# EAGLE design LB_BIT_o24_SYNTHSPEAKER-v03(4_5) (EAGLE 6.6.0)
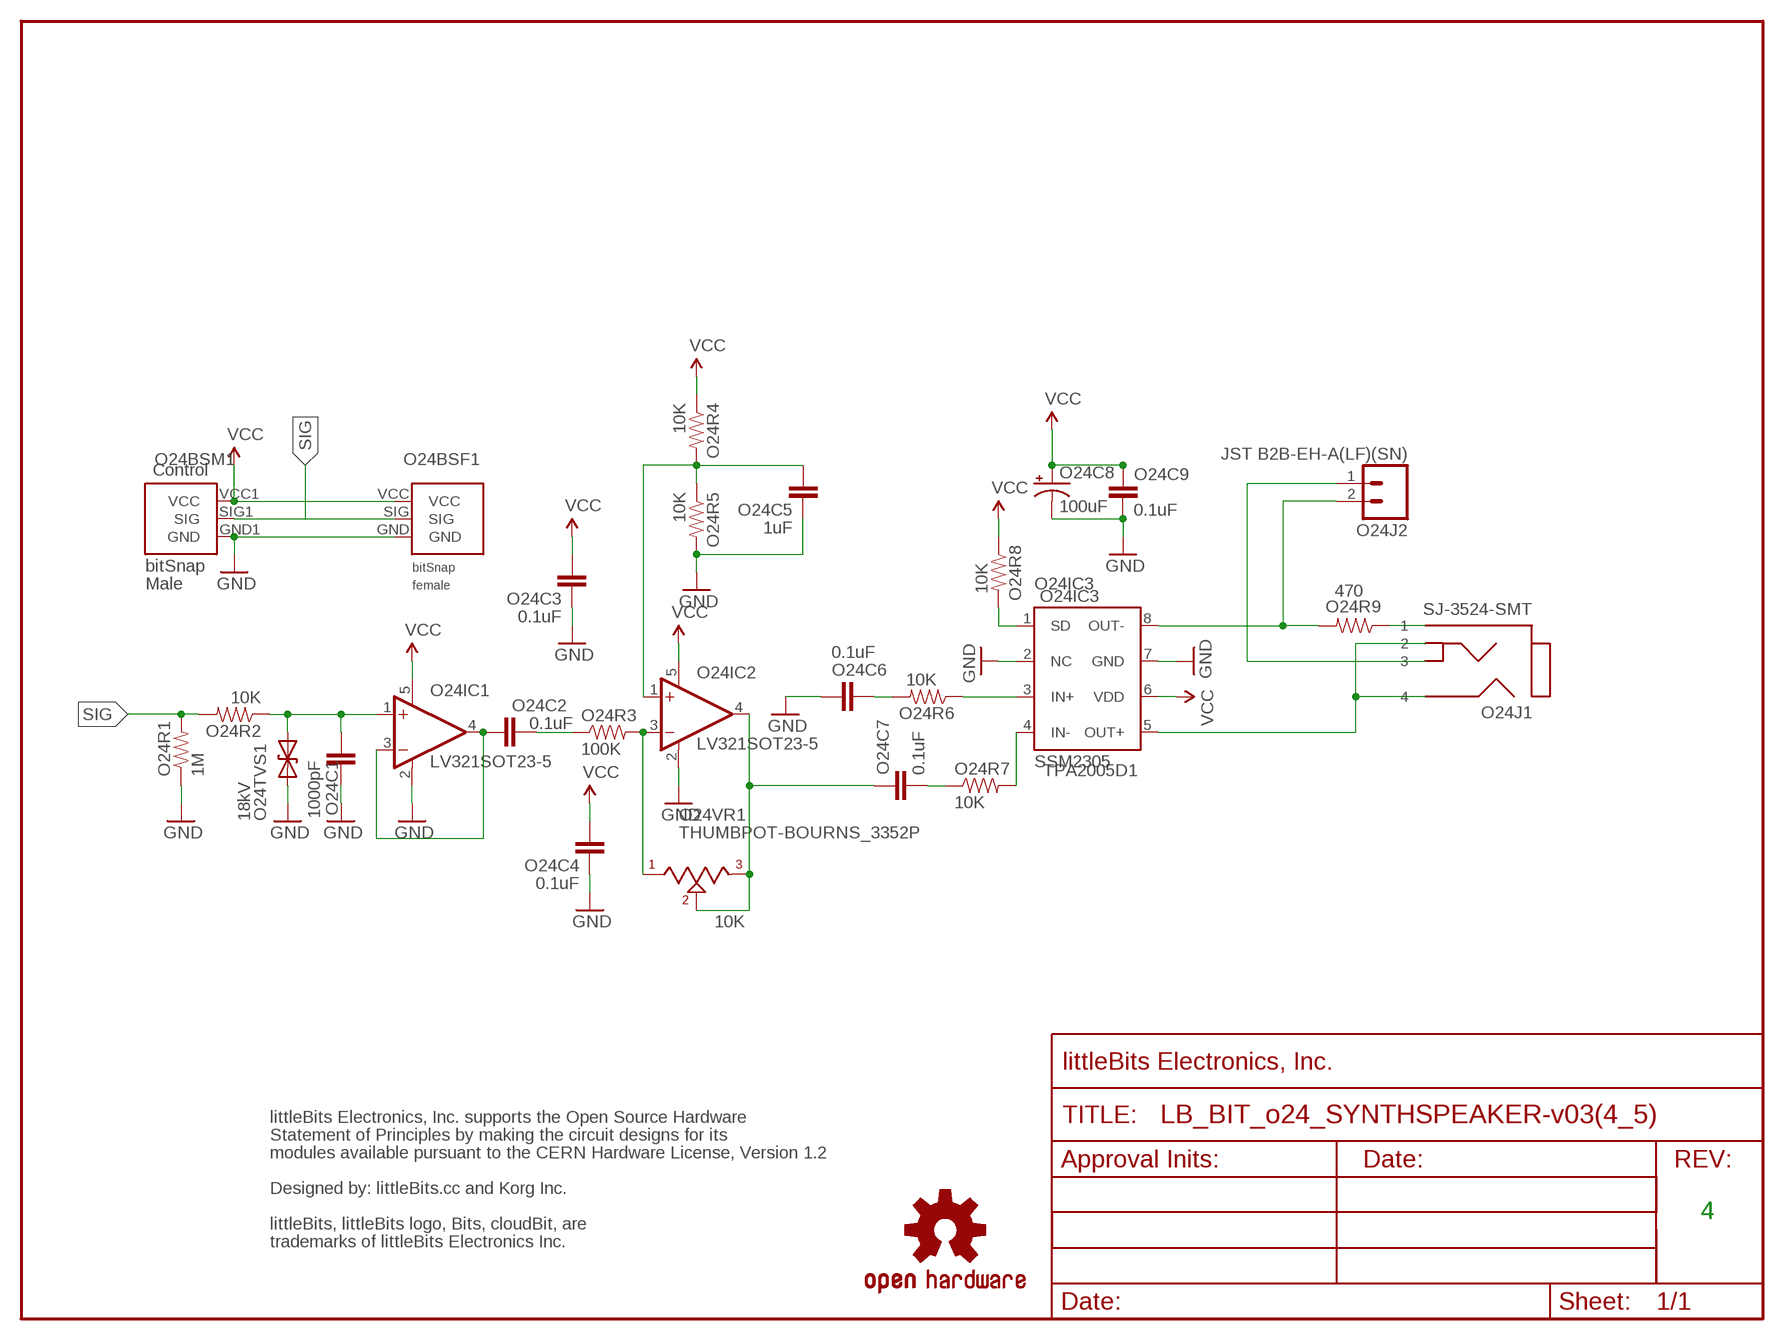
[diagram p0: schematic, sheet 1]

## Parts
$1_28_$  OSHW-LOGOL  [OSHW-LOGO-L]
FRAME1  FRAME-LETTER-OHWOHW  [FABDWG01-OHW]
O24BSF1  BITSNAP_V03_FEMALE  [BITSNAP_V03_FEMALE]
O24BSM1  BITSNAP_V03_MALE  [BITSNAP_V03_MALE]
O24C1  1000pF  CAPCAP-0603  [CAP-0603]
O24C2  0.1uF  CAPCAP-0603  [CAP-0603]
O24C3  0.1uF  CAPCAP-0603  [CAP-0603]
O24C4  0.1uF  CAPCAP-0603  [CAP-0603]
O24C5  1uF  CAPCAP-0603  [CAP-0603]
O24C6  0.1uF  CAPCAP-0603  [CAP-0603]
O24C7  0.1uF  CAPCAP-0603  [CAP-0603]
O24C8  100uF  CAP_POL3216  [EIA3216]
O24C9  0.1uF  CAPCAP-0603  [CAP-0603]
O24IC1  LV321SOT23-5  [SOT23-5]
O24IC2  LV321SOT23-5  [SOT23-5]
O24IC3  SSM2305  [MSOP08]
O24J1  SJ-3524-SMT  PHONO_JACK_SW  [PHONO_JACK_SW]
O24J2  JST B2B-EH-A(LF)(SN)  HDR-2  [H02-JST-B2B-EH-A]
O24R1  1M  RESISTOR0603  [RES-0603]
O24R2  10K  RESISTOR0603  [RES-0603]
O24R3  100K  RESISTOR0603  [RES-0603]
O24R4  10K  RESISTOR0603  [RES-0603]
O24R5  10K  RESISTOR0603  [RES-0603]
O24R6  10K  RESISTOR0603  [RES-0603]
O24R7  10K  RESISTOR0603  [RES-0603]
O24R8  10K  RESISTOR0603  [RES-0603]
O24R9  470  RESISTOR0603  [RES-0603]
O24TVS1  18kV  DIODE-TVSSOD-923  [SOD-923]
O24VR1  THUMBPOT-BOURNS_3352P  [THUMBPOT-BOURNS_3352]
U$1  OSHWCREDIT-KORG  [OSHWCREDIT-KORG]

## Nets
BIT_SIG: O24C2.2 O24IC1.3(-IN) O24IC1.4(OUT)
GND: O24BSF1.GND O24BSM1.GND1(GND) O24C1.1 O24C3.1 O24C4.1 O24C5.1 O24C6.2 O24C8.- O24C9.2 O24IC1.2(V-) O24IC2.2(V-) O24IC3.2(NC) O24IC3.7(GND) O24R1.1 O24R5.2 O24TVS1.1(A)
N$1: O24J1.3 O24J2.1
N$2: O24IC3.1(SD) O24R8.2
N$3: O24IC3.5(OUT+) O24J1.2 O24J1.4
N$4: O24C6.1 O24R6.2
N$5: O24J1.1 O24R9.1
N$6: O24IC3.3(IN+) O24R6.1
N$7: O24IC2.3(-IN) O24R3.2 O24VR1.3
N$8: O24C7.1 O24IC2.4(OUT) O24VR1.1 O24VR1.2
N$9: O24C5.2 O24IC2.1(+IN) O24R4.2 O24R5.1
N$10: O24C7.2 O24R7.1
N$11: O24C2.1 O24R3.1
N$31: O24IC3.4(IN-) O24R7.2
N$34: O24C1.2 O24IC1.1(+IN) O24R2.1 O24TVS1.2(C)
SIG: O24BSF1.SIG O24BSM1.SIG1(SIG) O24R1.2 O24R2.2
SPKR_SW: O24IC3.8(OUT-) O24J2.2 O24R9.2
VCC: O24BSF1.VCC O24BSM1.VCC1(VCC) O24C3.2 O24C4.2 O24C8.+ O24C9.1 O24IC1.5(V+) O24IC2.5(V+) O24IC3.6(VDD) O24R4.1 O24R8.1

## Notes on the sheet
- Control
- O24IC3
- TPA2005D1
- 10K
- 4

## Library data of the parts
$1_28_$ = LITTLEBITS:OSHW-LOGO: Open Source Hardware Logo This logo indicates the piece of hardware it is found on incorporates a OSHW license and/or adheres to the definition of open source hardware found here: http://freedomdefined.org/OSHW
FRAME1 = LITTLEBITS:FRAME-LETTER-OHW
O24BSF1 = bitSnap:BITSNAP_V03_FEMALE
O24BSM1 = bitSnap:BITSNAP_V03_MALE
O24C1-O24C7 O24C9 = LITTLEBITS:CAP
O24C8 = LITTLEBITS:CAP_POL
O24IC1 O24IC2 = LITTLEBITS:LV321
O24IC3 = LITTLEBITS:SSM2305
O24J1 = LITTLEBITS:PHONO_JACK_SW
O24J2 = LITTLEBITS:HDR-2
O24R1-O24R9 = LITTLEBITS:RESISTOR
O24TVS1 = LITTLEBITS:DIODE-TVS: Bidirectional Transient Voltage Suppression Diode: Device conducts in avalanche mode after reaching a part dependent voltage threshold. Used for limiting voltage spikes on ESD sensitive inputs and outputs.; IEC_ESD_PROT0: +/-18kV; LB_PN: ?; MPN: ESD9B5.0ST5G; V_CLAMP: ?; V_OPERATION: 5V
O24VR1 = LITTLEBITS:THUMBPOT-BOURNS_3352
U$1 = LITTLEBITS:OSHWCREDIT-KORG

## Board
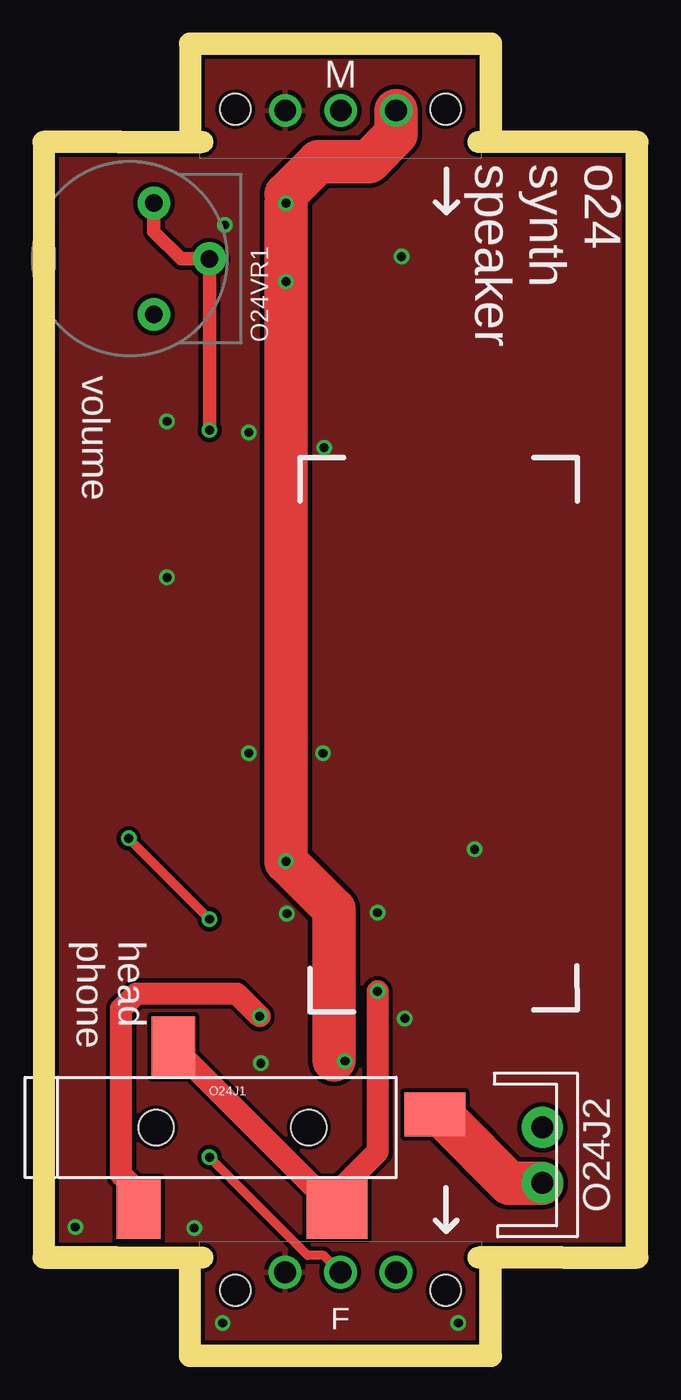
[diagram p1: board, top side]
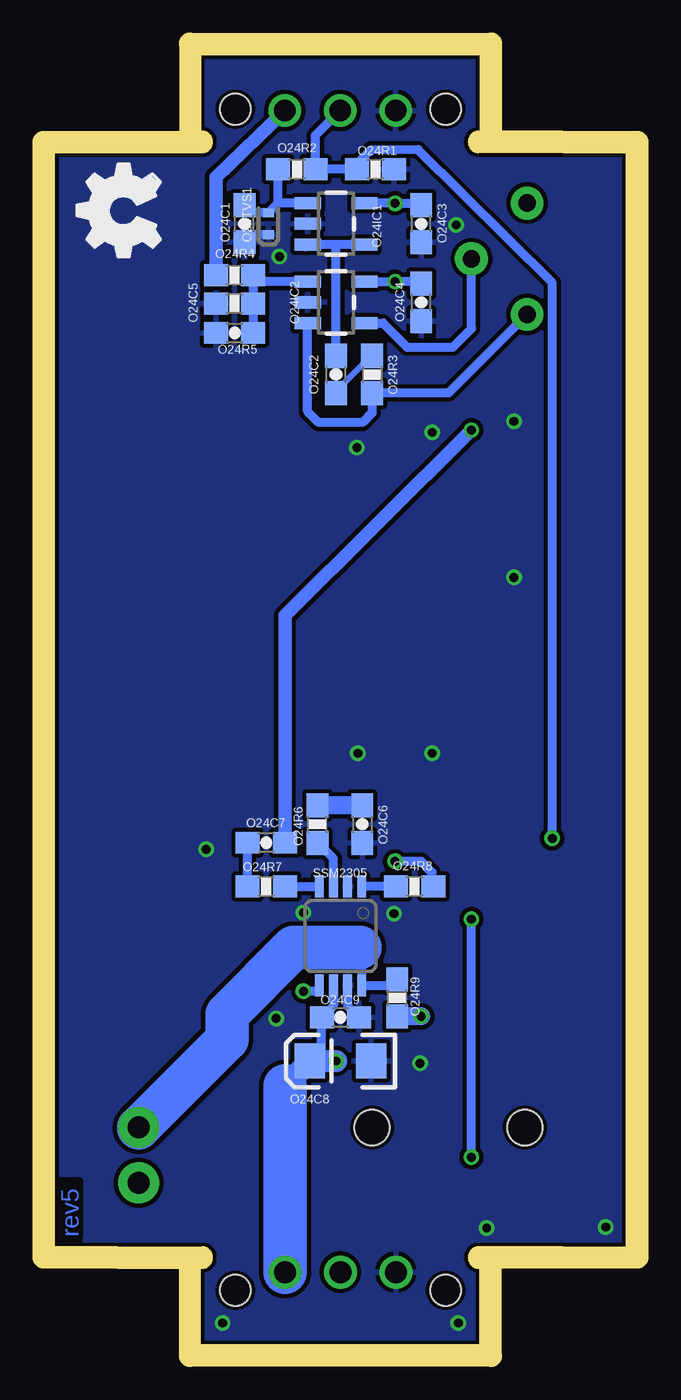
[diagram p2: board, bottom side, seen from below]

Size 26.2 x 59.1 mm. Coordinates in mm from the lower left corner, seen from the top.
Outline: 2.9,4.5 0,4.5 0,54.6 2.9,54.6
Outline: 23.3,4.5 26.2,4.5 26.2,54.6 23.3,54.6
Copper layers (1*16): Top 0.035mm / dielectric 1.5mm / Bottom 0.035mm
Design rules "littleBitsDRC": minimum track width 0.2mm, minimum drill 0.4mm, track to track 0.2mm, track to pad 0.2mm, pad to pad 0.2mm, via to via 0.2mm, smd to smd 0mil, copper to edge 0.2mm, drill to drill 0.2mm, minimum pad ring 0.2mm, minimum via ring 0.15mm, stop-mask expansion 0.1mm, vias tented up to drill 0mil, thermal gap 0.2mm
Milling: 6 lines

### Footprints (pad centres in the part's own frame; a part is rotated, then mirrored left to right if it is on the bottom)
BITSNAP_V03_FEMALE = drill 1: GND 3.91,3.33; SIG 6.45,3.33; VCC 8.99,3.33 | hole 1.4: 1.63,2.5; 11.27,2.5
BITSNAP_V03_MALE = drill 1: GND1 8.98,2.56; SIG1 6.44,2.56; VCC1 3.9,2.56 | hole 1.4: 11.27,2.5; 1.63,2.5
CAP-0603 = smd 1.1 x 1: 1 -0.85,0; 2 0.85,0
EIA3216 = smd 1.4 x 1.6: + 1.4,0; - -1.4,0
SOT23-5 = smd 0.55 x 1.2: 1 -0.95,-1.3; 2 0,-1.3; 3 0.95,-1.3; 4 0.95,1.3; 5 -0.95,1.3
MSOP08 = smd 0.4 x 1: 1 0.294,-0.993; 2 0.944,-0.993; 3 1.594,-0.993; 4 2.244,-0.993; 5 2.244,3.532; 6 1.594,3.532; 7 0.944,3.532; 8 0.294,3.532
PHONO_JACK_SW = smd 2 x 2.8: 1 -4.501,-3.844; 4 -2.901,3.556 | smd 2.8 x 2.8: 2 4.599,-3.844 | smd 2.8 x 2: 3 9.074,0.461 | hole 1.6: -3.701,-0.144; 3.299,-0.144
H02-JST-B2B-EH-A = drill 1.016 pad 1.88: 1 1.27,0; 2 -1.27,0
RES-0603 = smd 1.1 x 1: 1 -0.85,0; 2 0.85,0
SOD-923 = smd 0.4 x 0.5: 1 -0.5,0; 2 0.5,0
THUMBPOT-BOURNS_3352 = drill 0.8 pad 1.5: 1 2.55,-1.1; 2 0,-3.65; 3 -2.55,-1.1

### Placement (x,y rotation side)
$1_28_$  27.35,-52.25 0 top  (outside the outline)
FRAME1  55.65,15.8 0 top  (outside the outline)
O24BSF1  6.65,0 0 top
O24BSM1  19.55,59.1 180 top
O24C1  17.5,51.35 90 bottom
O24C2  13.3,44.45 90 bottom
O24C3  9.4,51.35 90 bottom
O24C4  9.4,47.75 90 bottom
O24C5  17.95,46.35 0 bottom
O24C6  12.1,23.85 270 bottom
O24C7  16.5,23 180 bottom
O24C8  13.1,13 180 bottom
O24C9  13.1,15 0 bottom
O24IC1  13.3,51.35 270 bottom
O24IC2  13.3,47.75 270 bottom
O24IC3  11.83,20 180 bottom
O24J1  8.35,10.1 0 top
O24J2  22.35,8.7 270 top
O24R1  11.5,53.85 180 bottom
O24R2  15.1,53.85 0 bottom
O24R3  11.65,44.45 270 bottom
O24R4  17.95,49 0 bottom
O24R5  17.95,47.7 180 bottom
O24R6  14.15,23.85 90 bottom
O24R7  16.5,21 0 bottom
O24R8  9.7,21 180 bottom
O24R9  10.5,15.9 90 bottom
O24TVS1  16.4,51.35 90 bottom
O24VR1  3.45,49.75 90 top
U$1  -21.6,-55.65 0 top  (outside the outline)
U$8  [OSHW_FILLX150_NOTEXT]  21.36,49 0 top

### Tracks (layer width: path | path; a pad name or v marks a point on that pad's centre or on a via)
BIT_SIG
  Bottom 0.406: 14.7,50.3 O24IC1.3 13.2,50.4 | O24IC1.4 13.2,50.4 | O24IC1.4 | O24IC1.4 12.05,50.35 | 13.2,50.4 13.3,50.3 O24C2.2
GND  (via drill 0.41)
  Bottom 0.406: O24IC3.7 12.77,15.52 O24C9.2 | O24TVS1.1 17.15,50.85 O24C1.1
  other vias: 14.8,19.8 10.65,19.75 8.9,27.1 19.25,22.7 8.9,41.8 12.35,41.1 7.7,1 18.5,1 5.15,42.3 5.15,35.15 16.05,14.95 12.3,27.1 9.45,12.9 0.95,5.4 6.4,5.35 7.8,51.3 15.9,49.85
  pour Top: 0,0 26.2,0 26.2,59.1 0,59.1
  pour Bottom: 0,0 26.2,0 26.2,59.1 0,59.1
N$1
  Top 0.813: O24J1.3 17.95,10.94 17.95,10.3 | 22.32,7.4 O24J2.1
  Top 1.016: O24J1.3 17.91,10.91 17.85,10.95
  Top 2: 17.95,10.3 20.85,7.4 22.32,7.4
N$2
  Bottom 0.406: O24R8.2 O24IC3.1
N$3  (via drill 0.41)
  Top 0.406: 12.96,7.01 O24J1.2 12.6,6.51
  Top 1: v14.8,16.2 14.8,8.85 | O24J1.4 12.6,6.51
  Top 1.016: 14.8,8.85 12.96,7.01
  Bottom 0.406: O24IC3.5 14.11,16.2 v14.8,16.2
N$4
  Bottom 0.813: O24C6.1 O24R6.2
N$5  (via drill 0.41)
  Top 0.813: O24J1.1 3.79,7.06
  Top 1: 3.79,7.06 3.05,7.8 3.05,15.4 3.75,16.1 8.35,16.1 v9.4,15.05
  Bottom 0.813: v9.4,15.05 O24R9.1
N$6
  Bottom 0.406: O24IC3.3 13.42,22.27 O24R6.1
N$7
  Bottom 0.406: O24VR1.3 8.15,43.6 O24R3.2 11.65,42.7 12.1,42.25 14.1,42.25 14.6,42.75 O24IC2.3 | O24IC2.3
N$8  (via drill 0.41)
  Top 0.61: O24VR1.1 4.55,51 5.8,49.75 O24VR1.2 v7.1,41.9
  Bottom 0.406: O24IC2.4 11.15,46.8 10.05,45.7 7.95,45.7 7.1,46.55 O24VR1.2
  Bottom 0.61: O24C7.1 15.65,33.4 v7.1,41.9
N$9
  Bottom 0.406: O24C5.2 O24R5.1 O24R4.2 16.75,48.7 O24IC2.1
N$10
  Bottom 0.406: O24R7.1 O24C7.2
N$11
  Bottom 0.254: O24R3.1 11.8,45.2 12.9,44.1 12.95,43.95 O24C2.1
N$31
  Bottom 0.406: O24R7.2 O24IC3.4
N$34
  Bottom 0.406: O24IC1.1 15.95,52.3 | 15.95,52.3 O24R2.1 | 15.95,52.3 O24TVS1.2 17.15,51.85 O24C1.2
SIG  (via drill 0.41)
  Top 0.406: O24BSF1.SIG 12.33,4.1 11.6,4.1 v7.1,8.6 | v7.1,19.5 v3.4,23.2
  Bottom 0.4: 9.55,54.75 11.7,54.75 12.25,54.2
  Bottom 0.406: O24BSM1.SIG1 14.25,55.4 O24R2.2 O24R1.2 12.25,54.2 | v7.1,8.6 v7.1,19.5 | v3.4,23.2 3.4,48.65 9.55,54.75
SPKR_SW
  Bottom 0.406: O24IC3.8 | O24IC3.8 10.78,16.47 O24R9.2 | O24IC3.8 12.12,17.37 12.2,18.2
  Bottom 1: 22.35,9.95 O24J2.2
  Bottom 2: 12.2,18.2 15.25,18.2 18.3,15.15 18.3,14 22.35,9.95
VCC  (via drill 0.41)
  Top 0.406: v10.6,48.7 10.65,48.65 10.6,48.45
  Top 1: v13.3,13 12.8,13.05 | v10.6,52.29 10.6,52.7
  Top 2: O24BSM1.VCC1 15.65,55.45 14.4,54.2 12.1,54.2 10.6,52.7 | v10.6,52.29 10.6,50.1 10.6,48.45 10.6,45 v10.6,22.15 12.8,19.95 12.8,13.05
  Bottom 0.406: O24R8.1 8.9,21.05 8.9,21.65 9.4,22.15 v10.6,22.15 | 9.4,52.1 O24C3.2 9.49,52.29 v10.6,52.29 O24IC1.5 | O24C8.+ 14,13 14,14.95 O24C9.1 13.42,15.53 O24IC3.6 | O24IC2.5 v10.6,48.7 | 10.3,48.7 v10.6,48.7 | O24C4.2 9.5,48.7 v10.6,48.7
  Bottom 0.61: O24R4.1 18.8,53.49 O24BSM1.VCC1
  Bottom 1: 14,13 v13.3,13 | O24C8.+ 15.64,11.86
  Bottom 2: 15.64,11.86 O24BSF1.VCC

### Text on the board
Bottom: rev5
tPlace: o24 / synth / speaker | volume | head / phone
dxf: 5 | Synth SPEAKER BIT